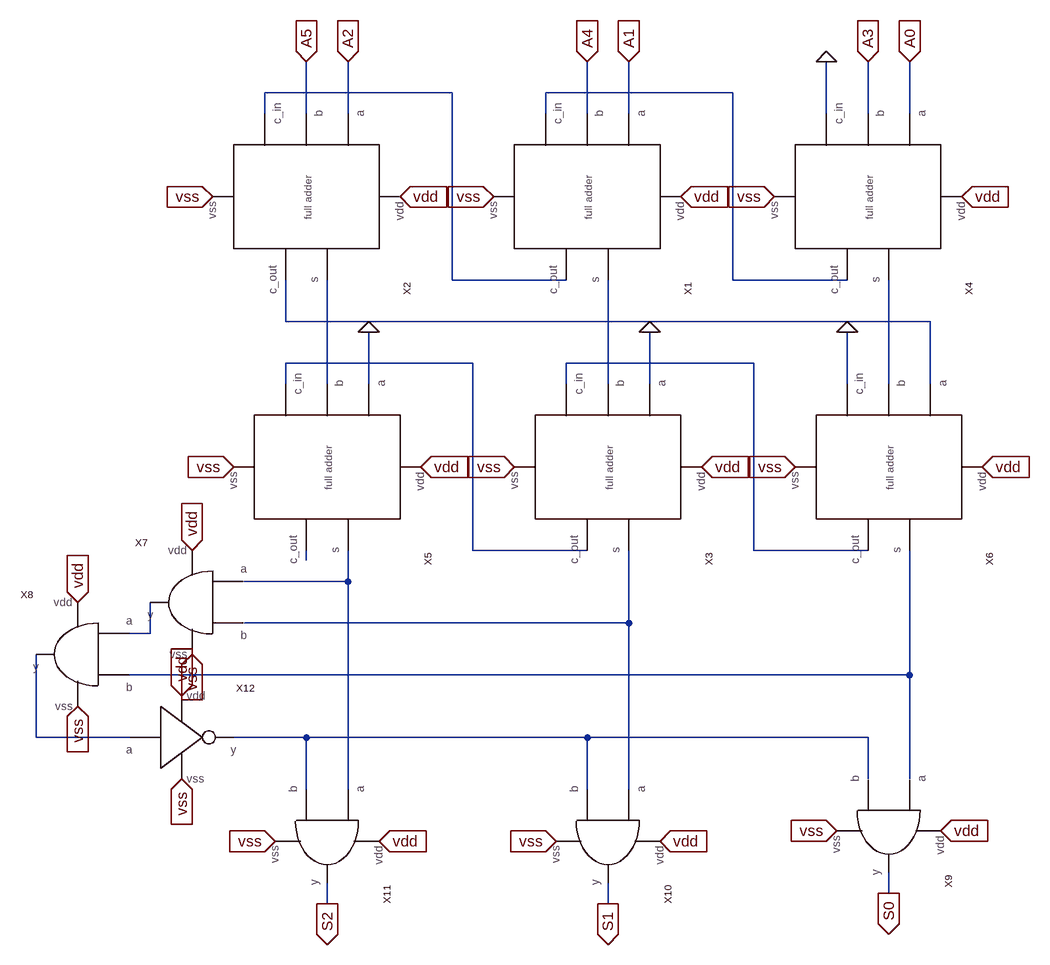
[diagram p0: schematic mod_seven.asc]
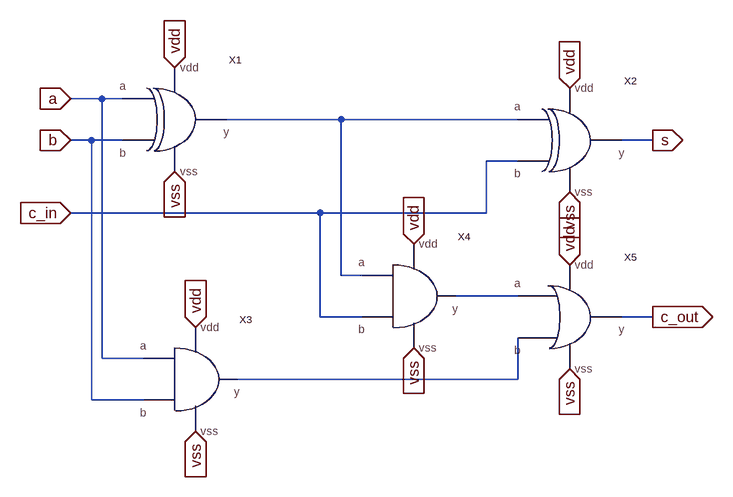
[diagram p1: sub-circuit full_adder.asc]
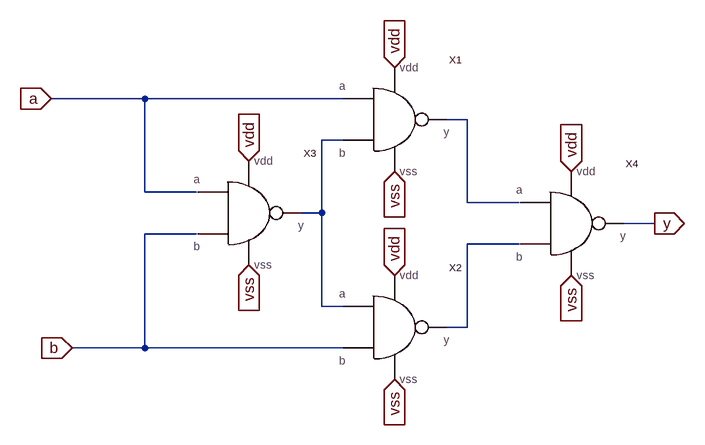
[diagram p2: sub-circuit xor.asc]
mod_seven.asc, the LTspice schematic file:
Version 4
SHEET 1 1208 736
WIRE 16 -944 -272 -944
WIRE 448 -944 160 -944
WIRE -272 -912 -272 -944
WIRE -208 -912 -208 -992
WIRE -144 -912 -144 -992
WIRE 160 -912 160 -944
WIRE 224 -912 224 -992
WIRE 288 -912 288 -992
WIRE 592 -912 592 -992
WIRE 656 -912 656 -992
WIRE 720 -912 720 -992
WIRE 16 -656 16 -944
WIRE 192 -656 16 -656
WIRE 448 -656 448 -944
WIRE 624 -656 448 -656
WIRE -240 -592 -240 -656
WIRE 752 -592 -240 -592
WIRE 48 -528 -240 -528
WIRE 480 -528 192 -528
WIRE -240 -496 -240 -528
WIRE -176 -496 -176 -656
WIRE -112 -496 -112 -576
WIRE 192 -496 192 -528
WIRE 256 -496 256 -656
WIRE 320 -496 320 -576
WIRE 624 -496 624 -576
WIRE 688 -496 688 -656
WIRE 752 -496 752 -592
WIRE 48 -240 48 -528
WIRE 224 -240 48 -240
WIRE 480 -240 480 -528
WIRE 656 -240 480 -240
WIRE -208 -224 -208 -240
WIRE -144 -192 -144 -240
WIRE -144 -192 -304 -192
WIRE 288 -128 288 -240
WIRE 288 -128 -304 -128
WIRE -448 -112 -448 -160
WIRE -448 -112 -480 -112
WIRE 720 -48 720 -240
WIRE 720 -48 -480 -48
WIRE -624 48 -624 -80
WIRE -480 48 -624 48
WIRE -208 48 -320 48
WIRE 224 48 -208 48
WIRE 656 48 224 48
WIRE 656 112 656 48
WIRE 720 112 720 -48
WIRE -208 128 -208 48
WIRE -144 128 -144 -192
WIRE 224 128 224 48
WIRE 288 128 288 -128
WIRE 688 288 688 256
WIRE -176 304 -176 272
WIRE 256 304 256 272
FLAG 288 -992 A1
IOPIN 288 -992 In
FLAG 224 -992 A4
IOPIN 224 -992 In
FLAG 720 -992 A0
IOPIN 720 -992 In
FLAG 656 -992 A3
IOPIN 656 -992 In
FLAG -208 -992 A5
IOPIN -208 -992 In
FLAG 320 -576 0
FLAG -112 -576 0
FLAG -64 -784 vdd
IOPIN -64 -784 In
FLAG 368 -784 vdd
IOPIN 368 -784 In
FLAG 800 -784 vdd
IOPIN 800 -784 In
FLAG 832 -368 vdd
IOPIN 832 -368 In
FLAG 400 -368 vdd
IOPIN 400 -368 In
FLAG -32 -368 vdd
IOPIN -32 -368 In
FLAG -352 -784 vss
IOPIN -352 -784 In
FLAG 80 -784 vss
IOPIN 80 -784 In
FLAG 512 -784 vss
IOPIN 512 -784 In
FLAG 544 -368 vss
IOPIN 544 -368 In
FLAG 112 -368 vss
IOPIN 112 -368 In
FLAG -320 -368 vss
IOPIN -320 -368 In
FLAG 592 -992 0
FLAG -144 -992 A2
IOPIN -144 -992 In
FLAG 624 -576 0
FLAG -560 0 vss
IOPIN -560 0 In
FLAG -400 112 vss
IOPIN -400 112 In
FLAG -384 -80 vss
IOPIN -384 -80 In
FLAG -256 208 vss
IOPIN -256 208 In
FLAG 176 208 vss
IOPIN 176 208 In
FLAG 608 192 vss
IOPIN 608 192 In
FLAG -560 -160 vdd
IOPIN -560 -160 In
FLAG -384 -240 vdd
IOPIN -384 -240 In
FLAG -96 208 vdd
IOPIN -96 208 In
FLAG 336 208 vdd
IOPIN 336 208 In
FLAG 768 192 vdd
IOPIN 768 192 In
FLAG -176 304 S2
IOPIN -176 304 Out
FLAG 256 304 S1
IOPIN 256 304 Out
FLAG 688 288 S0
IOPIN 688 288 Out
FLAG -400 -16 vdd
IOPIN -400 -16 In
SYMBOL full_adder 128 -784 R90
SYMATTR InstName X1
SYMBOL full_adder -304 -784 R90
SYMATTR InstName X2
SYMBOL full_adder 560 -784 R90
SYMATTR InstName X4
SYMBOL full_adder 160 -368 R90
SYMATTR InstName X3
SYMBOL full_adder -272 -368 R90
SYMATTR InstName X5
SYMBOL full_adder 592 -368 R90
SYMATTR InstName X6
SYMBOL and -384 -160 M0
SYMATTR InstName X7
SYMBOL and -560 -80 M0
SYMATTR InstName X8
SYMBOL and 688 192 R90
SYMATTR InstName X9
SYMBOL and 256 208 R90
SYMATTR InstName X10
SYMBOL and -176 208 R90
SYMATTR InstName X11
SYMBOL not -400 48 R0
SYMATTR InstName X12

full_adder.asc, the sub-circuit schematic file:
Version 4
SHEET 1 1124 680
WIRE 128 -80 80 -80
WIRE 160 -80 128 -80
WIRE 496 -48 320 -48
WIRE 768 -48 496 -48
WIRE 112 -16 80 -16
WIRE 160 -16 112 -16
WIRE 976 -16 928 -16
WIRE 768 16 720 16
WIRE 464 96 80 96
WIRE 720 96 720 16
WIRE 720 96 464 96
WIRE 496 192 496 -48
WIRE 528 192 496 192
WIRE 768 224 672 224
WIRE 464 256 464 96
WIRE 528 256 464 256
WIRE 976 256 928 256
WIRE 128 320 128 -80
WIRE 192 320 128 320
WIRE 768 352 768 288
WIRE 768 352 336 352
WIRE 112 384 112 -16
WIRE 192 384 112 384
FLAG 80 -80 a
IOPIN 80 -80 In
FLAG 240 -128 vdd
IOPIN 240 -128 In
FLAG 976 -16 s
IOPIN 976 -16 Out
FLAG 240 32 vss
IOPIN 240 32 In
FLAG 80 -16 b
IOPIN 80 -16 In
FLAG 848 -96 vdd
IOPIN 848 -96 In
FLAG 848 64 vss
IOPIN 848 64 In
FLAG 80 96 c_in
IOPIN 80 96 In
FLAG 272 272 vdd
IOPIN 272 272 In
FLAG 272 432 vss
IOPIN 272 432 In
FLAG 608 144 vdd
IOPIN 608 144 In
FLAG 608 304 vss
IOPIN 608 304 In
FLAG 976 256 c_out
IOPIN 976 256 Out
FLAG 848 176 vdd
IOPIN 848 176 In
FLAG 848 336 vss
IOPIN 848 336 In
SYMBOL xor 240 -48 R0
SYMATTR InstName X1
SYMBOL xor 848 -16 R0
SYMATTR InstName X2
SYMBOL and 272 352 R0
SYMATTR InstName X3
SYMBOL and 608 224 R0
SYMATTR InstName X4
SYMBOL or 848 256 R0
SYMATTR InstName X5

xor.asc, the sub-circuit schematic file:
Version 4
SHEET 1 1608 784
WIRE 144 128 0 128
WIRE 448 128 144 128
WIRE 640 160 608 160
WIRE 448 192 416 192
WIRE 144 272 144 128
WIRE 224 272 144 272
WIRE 640 288 640 160
WIRE 720 288 640 288
WIRE 416 304 416 192
WIRE 416 304 384 304
WIRE 928 320 880 320
WIRE 224 336 144 336
WIRE 720 352 640 352
WIRE 416 448 416 304
WIRE 448 448 416 448
WIRE 640 480 640 352
WIRE 640 480 608 480
WIRE 144 512 144 336
WIRE 144 512 32 512
WIRE 448 512 144 512
FLAG 0 128 a
IOPIN 0 128 In
FLAG 928 320 y
IOPIN 928 320 Out
FLAG 32 512 b
IOPIN 32 512 In
FLAG 304 224 vdd
IOPIN 304 224 In
FLAG 304 384 vss
IOPIN 304 384 In
FLAG 528 80 vdd
IOPIN 528 80 In
FLAG 528 240 vss
IOPIN 528 240 In
FLAG 528 400 vdd
IOPIN 528 400 In
FLAG 528 560 vss
IOPIN 528 560 In
FLAG 800 240 vdd
IOPIN 800 240 In
FLAG 800 400 vss
IOPIN 800 400 In
SYMBOL nand 304 304 R0
SYMATTR InstName X3
SYMBOL nand 528 160 R0
SYMATTR InstName X1
SYMBOL nand 528 480 R0
SYMATTR InstName X2
SYMBOL nand 800 320 R0
SYMATTR InstName X4

The netlist it stands for:
* mod_seven.asc
XX1 vdd vss A1 A4 N002 N007 N001 full_adder
XX2 vdd vss A2 A5 N001 N006 N003 full_adder
XX4 vdd vss A0 A3 0 N008 N002 full_adder
XX3 vdd vss 0 N007 N005 N011 N004 full_adder
XX5 vdd vss 0 N006 N004 N010 N009 full_adder
XX6 vdd vss N003 N008 0 N013 N005 full_adder
XX7 N010 N011 N012 vdd vss and  ; pins a b y vdd vss
XX8 N012 N013 N014 vdd vss and  ; pins a b y vdd vss
XX9 N013 N015 S0 vdd vss and  ; pins a b y vdd vss
XX10 N011 N015 S1 vdd vss and  ; pins a b y vdd vss
XX11 N010 N015 S2 vdd vss and  ; pins a b y vdd vss
XX12 N014 N015 vdd vss not  ; pins a y vdd vss

* block symbol definitions
.subckt full_adder vdd vss a b c_in s c_out
XX1 a b N001 vdd vss xor
XX2 N001 c_in s vdd vss xor
XX3 a b N003 vdd vss and  ; pins a b y vdd vss
XX4 N001 c_in N002 vdd vss and  ; pins a b y vdd vss
XX5 N002 N003 c_out vdd vss or  ; pins a b y vdd vss
.ends full_adder

.subckt xor a b y vdd vss
XX3 a b N002 vdd vss nand  ; pins a b y vdd vss
XX1 a N002 N001 vdd vss nand  ; pins a b y vdd vss
XX2 N002 b N003 vdd vss nand  ; pins a b y vdd vss
XX4 N001 N003 y vdd vss nand  ; pins a b y vdd vss
.ends xor

.backanno
.end